# Altium schematic sheet PLD_RadFET_Supply.SchDoc: Local Supply
size A3; SheetTotal: 32
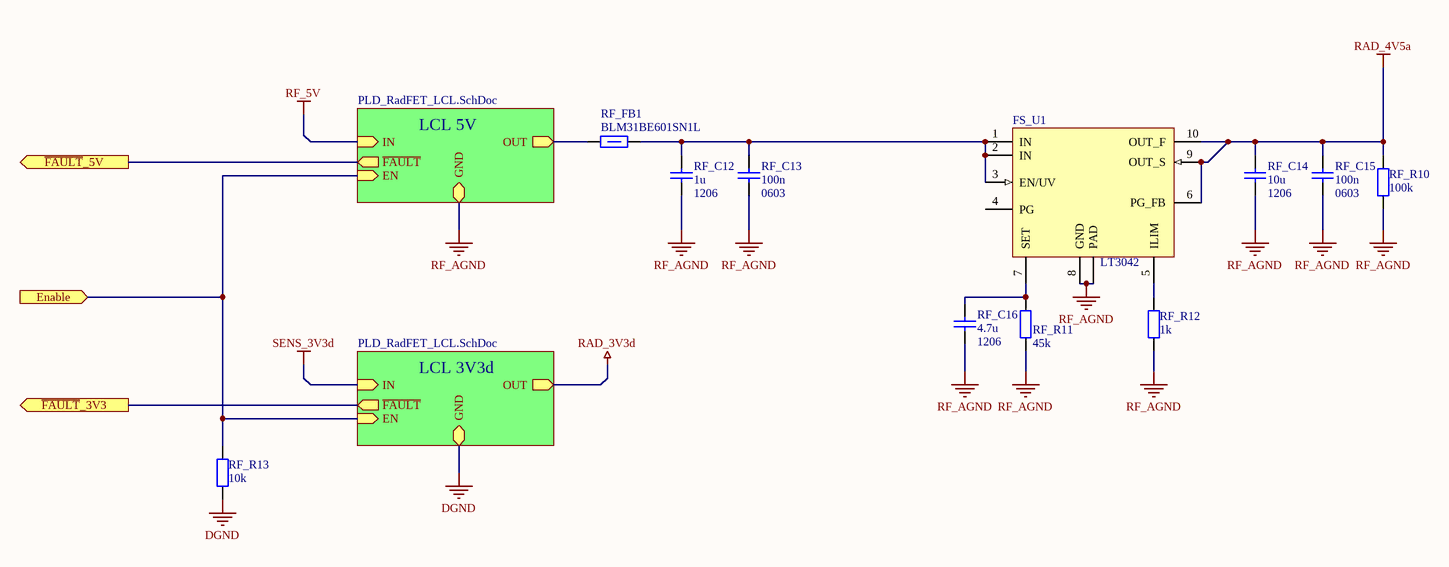
[diagram p0: PLD_RadFET_Supply.SchDoc]

## Parts
FS_U1  LT3042  [MSOP-10-M-thermal-pad]
RF_C12  value 1u  Package: 1206  [SMD_Capacitor_1206]  (hidden comment: Cap)
RF_C13  value 100n  Package: 0603  [SMD_Capacitor_0603]  (hidden comment: Cap)
RF_C14  value 10u  Package: 1206  [SMD_Capacitor_1206]  (hidden comment: Cap)
RF_C15  value 100n  Package: 0603  [SMD_Capacitor_0603]  (hidden comment: Cap)
RF_C16  value 4.7u  Package: 1206  [SMD_Capacitor_1206]  (hidden comment: Cap)
RF_FB1  ManufacturerPartNumber: BLM31BE601SN1L  [1206]  (hidden comment: 600R/100MHz)
RF_R10  100k  [SMD_Resistor_0603]
RF_R11  45k  [SMD_Resistor_0603]
RF_R12  1k  [SMD_Resistor_0603]
RF_R13  10k  [SMD_Resistor_0603]

## Sub-sheets
LCL 3V3d = PLD_RadFET_LCL.SchDoc: GND, IN (in), EN (in), OUT (out), ~{FAULT} (out)
LCL 5V = PLD_RadFET_LCL.SchDoc: GND, IN (in), EN (in), OUT (out), ~{FAULT} (out)

## Ports
Enable (in), ~{FAULT}_3V3 (out), ~{FAULT}_5V (out)

## Nets
DGND: RF_R13.1 ; sheet LCL 3V3d/GND
RAD_3V3d: sheet LCL 3V3d/OUT
RAD_4V5a: FS_U1.6(PG_FB) FS_U1.9(OUT_S) FS_U1.10(OUT_F) RF_C14.1 RF_C15.1 RF_R10.2
RF_5V: sheet LCL 5V/IN
RF_AGND: FS_U1.8(GND) FS_U1.11(PAD) RF_C12.2 RF_C13.2 RF_C14.2 RF_C15.2 RF_C16.2 RF_R10.1 RF_R11.1 RF_R12.1 ; sheet LCL 5V/GND
SENS_3V3d: sheet LCL 3V3d/IN
Enable: RF_R13.2 ; port Enable, sheet LCL 5V/EN, sheet LCL 3V3d/EN
~{FAULT}_3V3: port ~{FAULT}_3V3, sheet LCL 3V3d/~{FAULT}
~{FAULT}_5V: port ~{FAULT}_5V, sheet LCL 5V/~{FAULT}
NetFS_U1_1: FS_U1.1(IN) FS_U1.2(IN) FS_U1.3(EN/UV) RF_C12.1 RF_C13.1 RF_FB1.1
NetFS_U1_5: FS_U1.5(ILIM) RF_R12.2
NetFS_U1_7: FS_U1.7(SET) RF_C16.1 RF_R11.2
NetRF_FB1_2: RF_FB1.2 ; sheet LCL 5V/OUT

Not connected (* = marked no-connect by the designer): FS_U1 4(PG)

## Notes on the sheet
- Title:
- Project:
- Author:
- Model:
- Document Number:
- Checked by:
- Rev:
- Date:
- Approved by:
- Sheet:
- of
- File name:

## Library data of the parts
FS_U1 = LT3042: 20V, 200mA, Ultralow Noise, Ultrahigh PSRR RF Linear Regulator; PartNumber: LT3042; ComponentLink1Description: Manufacturer URL; ComponentLink1URL: http://www.linear.com/; ComponentLink2Description: Datasheet; ComponentLink2URL: http://cds.linear.com/docs/en/datasheet/3042fa.pdf
RF_FB1 = FerriteBead: Ferrite Bead; Manufacturer: Murata; HelpUrl: http://www.mouser.com/ds/2/281/c31e-794748.pdf; Supplier 1: Mouser; Value: 600R/100MHz; Mouser: 81-BLM31B601S
RF_R10-RF_R13 = Res: Package: 0603
  RF_R10: Value: 100k
  RF_R11: Value: 45k
  RF_R12: Value: 1k
  RF_R13: Value: 10k